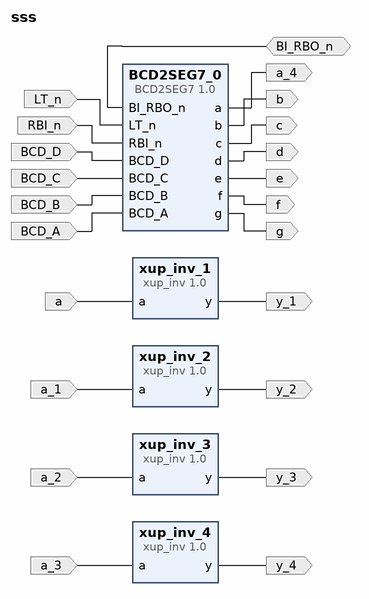
[diagram p0: block diagram of the top level]
# Vivado block design sss, xc7a35tcpg236-1, Vivado 2016.4
create_bd_design sss

create_bd_port -dir I LT_n
create_bd_port -dir I RBI_n
create_bd_port -dir I BCD_D
create_bd_port -dir I BCD_C
create_bd_port -dir I BCD_B
create_bd_port -dir I BCD_A
create_bd_port -dir I a
create_bd_port -dir I a_1
create_bd_port -dir I a_2
create_bd_port -dir I a_3
create_bd_port -dir O y_1
create_bd_port -dir O y_2
create_bd_port -dir O y_3
create_bd_port -dir O y_4
create_bd_port -dir O a_4
create_bd_port -dir O b
create_bd_port -dir O c
create_bd_port -dir O d
create_bd_port -dir O e
create_bd_port -dir O f
create_bd_port -dir O g
create_bd_port -dir IO BI_RBO_n

create_bd_cell -type ip -vlnv xilinx.com:xup:BCD2SEG7:1.0 BCD2SEG7_0
create_bd_cell -type ip -vlnv xilinx.com:xup:xup_inv:1.0 xup_inv_1
create_bd_cell -type ip -vlnv xilinx.com:xup:xup_inv:1.0 xup_inv_2
create_bd_cell -type ip -vlnv xilinx.com:xup:xup_inv:1.0 xup_inv_3
create_bd_cell -type ip -vlnv xilinx.com:xup:xup_inv:1.0 xup_inv_4

# ---- connections ----

connect_bd_net [get_bd_ports LT_n] [get_bd_pins BCD2SEG7_0/LT_n]
connect_bd_net [get_bd_ports RBI_n] [get_bd_pins BCD2SEG7_0/RBI_n]
connect_bd_net [get_bd_ports BCD_D] [get_bd_pins BCD2SEG7_0/BCD_D]
connect_bd_net [get_bd_ports BCD_C] [get_bd_pins BCD2SEG7_0/BCD_C]
connect_bd_net [get_bd_ports BCD_B] [get_bd_pins BCD2SEG7_0/BCD_B]
connect_bd_net [get_bd_ports BCD_A] [get_bd_pins BCD2SEG7_0/BCD_A]
connect_bd_net [get_bd_ports a] [get_bd_pins xup_inv_1/a]
connect_bd_net -net a_1_1 [get_bd_ports a_1] [get_bd_pins xup_inv_2/a]
connect_bd_net -net a_2_1 [get_bd_ports a_2] [get_bd_pins xup_inv_3/a]
connect_bd_net -net a_3_1 [get_bd_ports a_3] [get_bd_pins xup_inv_4/a]
connect_bd_net [get_bd_pins xup_inv_1/y] [get_bd_ports y_1]
connect_bd_net [get_bd_pins xup_inv_2/y] [get_bd_ports y_2]
connect_bd_net [get_bd_pins xup_inv_3/y] [get_bd_ports y_3]
connect_bd_net [get_bd_pins xup_inv_4/y] [get_bd_ports y_4]
connect_bd_net [get_bd_pins BCD2SEG7_0/a] [get_bd_ports a_4]
connect_bd_net [get_bd_pins BCD2SEG7_0/b] [get_bd_ports b]
connect_bd_net [get_bd_pins BCD2SEG7_0/c] [get_bd_ports c]
connect_bd_net [get_bd_pins BCD2SEG7_0/d] [get_bd_ports d]
connect_bd_net [get_bd_pins BCD2SEG7_0/e] [get_bd_ports e]
connect_bd_net [get_bd_pins BCD2SEG7_0/f] [get_bd_ports f]
connect_bd_net [get_bd_pins BCD2SEG7_0/g] [get_bd_ports g]
connect_bd_net [get_bd_ports BI_RBO_n] [get_bd_pins BCD2SEG7_0/BI_RBO_n]

validate_bd_design
save_bd_design
